# EAGLE design board_TMC2130 (EAGLE 9.7.0)
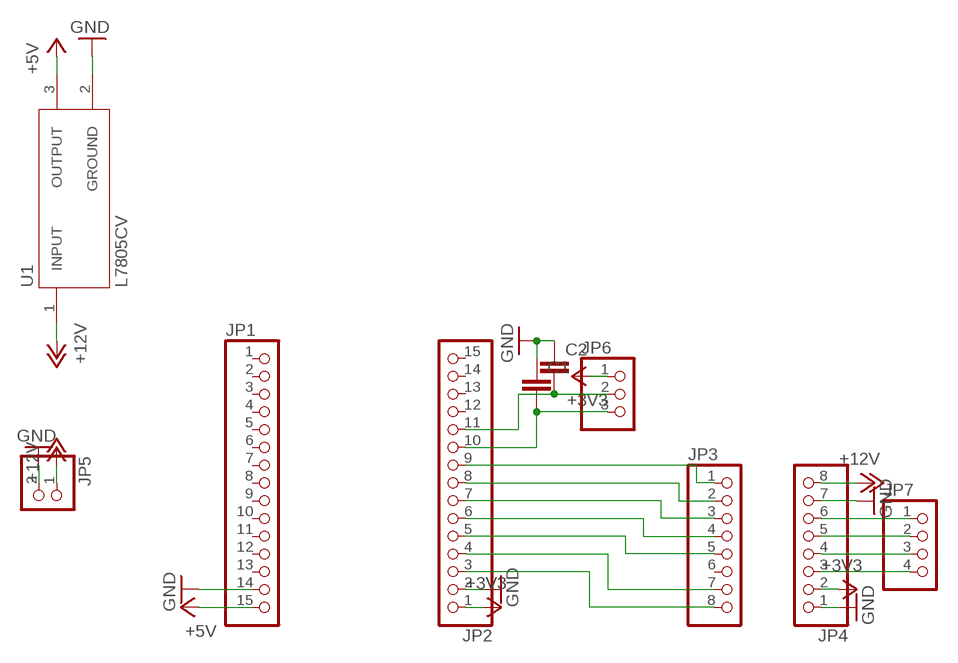
[diagram p0: schematic, sheet 1]

## Parts
C1  C-EU025-030X050  [C025-030X050]
C2  C-EU025-030X050  [C025-030X050]
JP1  PINHD-1X15  [1X15]
JP2  PINHD-1X15  [1X15]
JP3  PINHD-1X8  [1X08]
JP4  PINHD-1X8  [1X08]
JP5  PINHD-1X2  [1X02]
JP6  PINHD-1X3  [1X03]
JP7  PINHD-1X4  [1X04]
U1  L7805CV  [TO255P1040X460X1968-3]

## Nets
+3V3: JP2.1 JP4.2 JP6.1
+5V: JP1.15 U1.3(OUTPUT)
+12V: JP4.8 JP5.1 U1.1(INPUT)
GND: C1.1 C2.1 JP1.14 JP2.2 JP4.1 JP4.7 JP5.2 U1.2(GROUND)
N$1: C2.2 JP2.11 JP6.2
N$2: C1.2 JP2.10 JP6.3
N$3: JP2.9 JP3.1
N$4: JP2.7 JP3.3
N$5: JP2.6 JP3.4
N$6: JP2.5 JP3.5
N$7: JP2.8 JP3.2
N$8: JP4.6 JP7.1
N$9: JP4.5 JP7.2
N$10: JP4.4 JP7.3
N$11: JP4.3 JP7.4
N$12: JP2.4 JP3.7
N$13: JP2.3 JP3.8
Unconnected: JP1.1 JP1.2 JP1.3 JP1.4 JP1.5 JP1.6 JP1.7 JP1.8 JP1.9 JP1.10 JP1.11 JP1.12 JP1.13 JP2.12 JP2.13 JP2.14 JP2.15 JP3.6

## Library data of the parts
C1 C2 = rcl:C-EU: CAPACITOR, European symbol; SPICEPREFIX: C
JP1 JP2 = pinhead:PINHD-1X15: PIN HEADER
JP3 JP4 = pinhead:PINHD-1X8: PIN HEADER
JP5 = pinhead:PINHD-1X2: PIN HEADER
JP6 = pinhead:PINHD-1X3: PIN HEADER
JP7 = pinhead:PINHD-1X4: PIN HEADER
U1 = L7805CV:L7805CV: Standard Regulator Pos 5V 1.5A 3-Pin(3+Tab) TO-220 Standard Regulator Pos 5V 1.5A 3-Pin(3+Tab) TO-220; AVAILABILITY: Unavailable; DESCRIPTION: Linear Voltage Regulator IC 1 Output 1.5A TO-220; MF: STMicroelectronics; MP: L7805CV; PACKAGE: TO-220 STMicroelectronics; PRICE: None

## Board
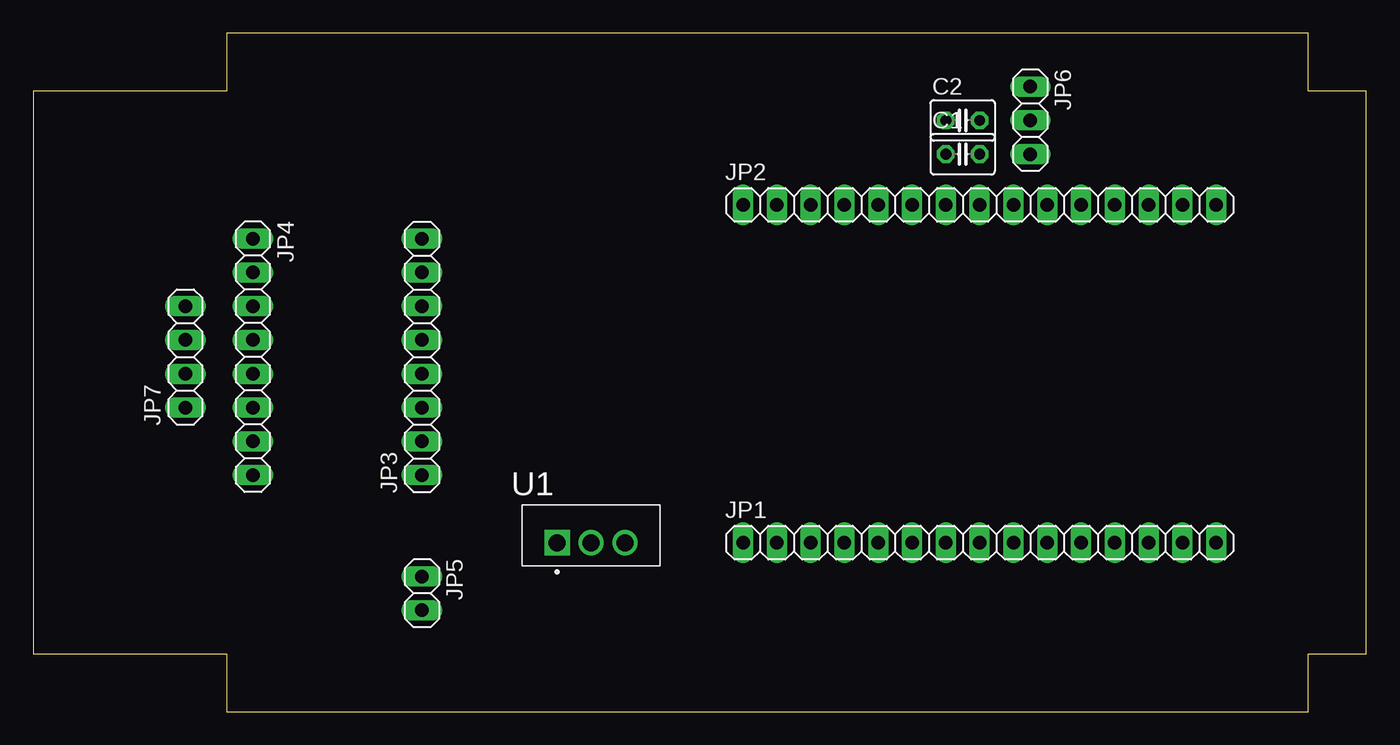
[diagram p1: board, top side]
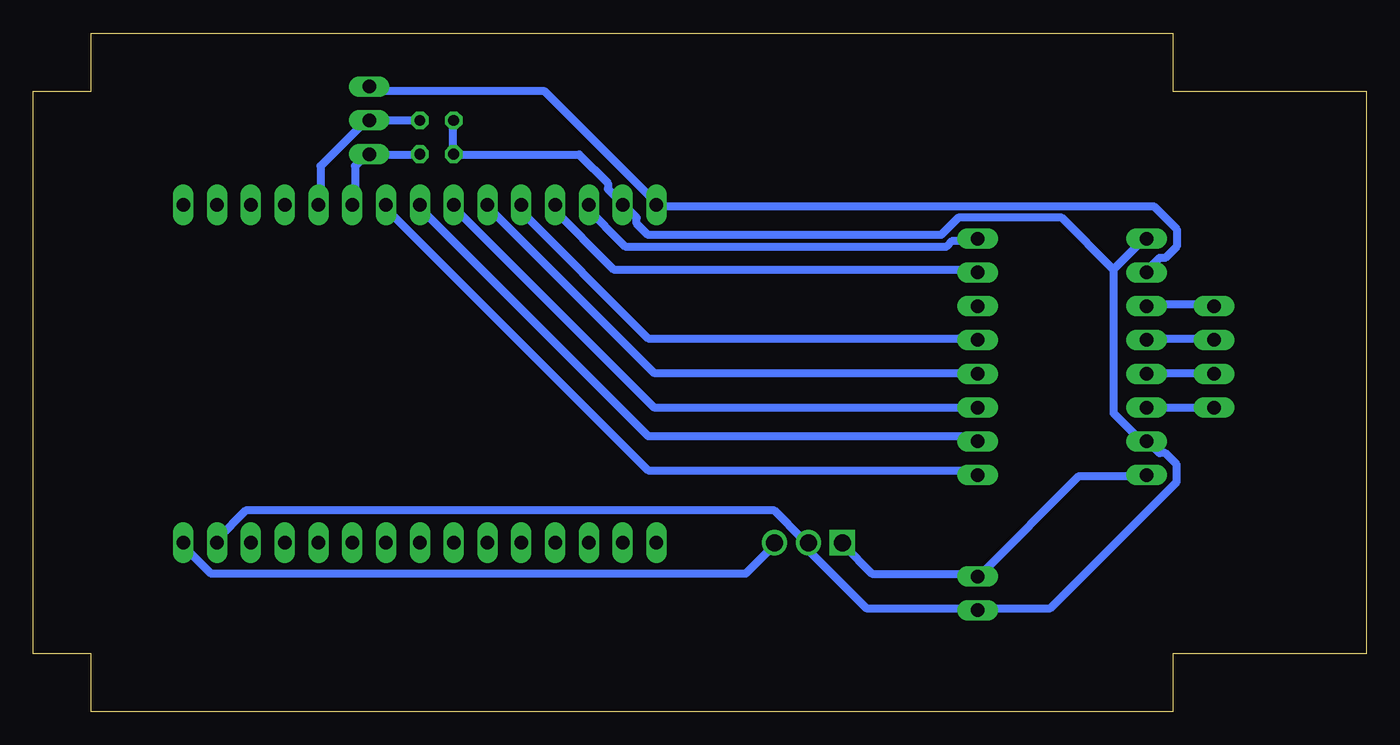
[diagram p2: board, bottom side, seen from below]

Size 100.18 x 51 mm. Coordinates in mm from the lower left corner, seen from the top.
Outline: 14.53,51 14.53,46.65 0,46.65 0,4.35 14.53,4.35 14.53,0 95.83,0 95.83,4.35 100.17,4.35 100.17,46.65 95.83,46.65 95.83,51 14.53,51
Copper layers (1*16): Top 0.035mm / dielectric 1.5mm / Bottom 0.035mm
Design rules "default *": minimum track width 24mil, minimum drill 0.35mm, track to track 10mil, track to pad 10mil, pad to pad 6mil, via to via 6mil, smd to smd 6mil, copper to edge 40mil, drill to drill 6mil, minimum pad ring 10mil, minimum via ring 8mil, stop-mask expansion 4mil, vias tented up to drill 0mil, thermal gap 10mil

### Footprints (pad centres in the part's own frame; a part is rotated, then mirrored left to right if it is on the bottom)
C025-030X050 = drill 0.813 octagon: 1 -1.27,0; 2 1.27,0
1X15 = drill 1.016 long: 1 -17.78,0; 2 -15.24,0; 3 -12.7,0; 4 -10.16,0; 5 -7.62,0; 6 -5.08,0; 7 -2.54,0; 8 0,0; 9 2.54,0; 10 5.08,0; 11 7.62,0; 12 10.16,0; 13 12.7,0; 14 15.24,0; 15 17.78,0
1X08 = drill 1.016 long: 1 -8.89,0; 2 -6.35,0; 3 -3.81,0; 4 -1.27,0; 5 1.27,0; 6 3.81,0; 7 6.35,0; 8 8.89,0
1X02 = drill 1.016 long: 1 -1.27,0; 2 1.27,0
1X03 = drill 1.016 long: 1 -2.54,0; 2 0,0; 3 2.54,0
1X04 = drill 1.016 long: 1 -3.81,0; 2 -1.27,0; 3 1.27,0; 4 3.81,0
TO255P1040X460X1968-3 = drill 1.27 pad 1.91 square: 1 0,0 | drill 1.27 pad 1.91: 2 2.55,0; 3 5.1,0

### Placement (x,y rotation side)
C1  69.85,41.91 0 top
C2  69.85,44.45 0 top
JP1  71.12,12.7 0 top
JP2  71.12,38.1 0 top
JP3  29.21,26.67 90 top
JP4  16.51,26.67 270 top
JP5  29.21,8.89 270 top
JP6  74.93,44.45 270 top
JP7  11.43,26.67 90 top
U1  39.37,12.7 0 top

### Tracks (layer width: path | path; a pad name or v marks a point on that pad's centre or on a via)
+3V3
  Bottom 0.61: JP4.2 16.41,33.25 15.54,34.11 15.11,34.11 14.25,34.98 14.25,36.27 15.98,38 53.11,38 JP2.1 53.54,38.43 61.75,46.63 74.7,46.63 JP6.1
+5V
  Bottom 0.61: JP1.15 88.52,12.52 88.52,12.09 86.79,10.36 46.63,10.36 44.48,12.52 U1.3
+12V
  Bottom 0.61: U1.1 39.29,12.52 37.13,10.36 29.36,10.36 JP5.1 28.93,10.36 21.59,17.7 16.84,17.7 JP4.8
GND
  Bottom 0.61: C2.1 68.66,44.04 68.66,42.32 C1.1 68.22,41.88 59.16,41.88 57,39.73 57,39.29 56.13,38.43 JP2.2 55.7,38 54.84,37.13 54.84,36.7 53.98,35.84 31.95,35.84 30.66,37.13 22.89,37.13 19,33.25 | 19,33.25 19,22.45 17.27,20.73 16.84,20.73 JP4.7 16.41,20.3 15.54,19.43 15.11,19.43 14.25,18.57 14.25,17.27 23.75,7.77 28.93,7.77 JP5.2 29.36,7.77 37.57,7.77 42.32,12.52 U1.2 42.32,12.95 44.48,15.11 84.2,15.11 86.36,12.95 JP1.14 | 19,33.25 16.84,35.41 JP4.1
N$1
  Bottom 0.61: C2.2 71.25,44.48 74.7,44.48 JP6.2 75.13,44.48 78.59,41.02 78.59,38.43 JP2.11
N$2
  Bottom 0.61: C1.2 71.25,41.88 74.7,41.88 JP6.3 75.13,41.88 76,41.02 76,38.43 JP2.10
N$3
  Bottom 0.61: JP3.1 29.36,18.14 53.98,18.14 73.84,38 JP2.9
N$4
  Bottom 0.61: JP3.3 29.36,22.89 53.54,22.89 68.66,38 JP2.7
N$5
  Bottom 0.61: JP3.4 29.36,25.48 53.54,25.48 66.06,38 JP2.6
N$6
  Bottom 0.61: JP3.5 29.36,28.07 53.98,28.07 63.91,38 JP2.5
N$7
  Bottom 0.61: JP3.2 29.36,20.73 53.98,20.73 71.25,38 JP2.8
N$8
  Bottom 0.61: JP7.1 11.66,22.89 16.41,22.89 JP4.6
N$9
  Bottom 0.61: JP7.2 11.66,25.48 16.41,25.48 JP4.5
N$10
  Bottom 0.61: JP7.3 11.66,28.07 16.41,28.07 JP4.4
N$11
  Bottom 0.61: JP7.4 11.66,30.66 16.41,30.66 JP4.3
N$12
  Bottom 0.61: JP3.7 29.36,33.25 56.57,33.25 61.32,38 JP2.4
N$13
  Bottom 0.61: JP3.8 29.36,35.41 31.09,35.41 31.52,34.98 55.7,34.98 58.73,38 JP2.3